# EAGLE design CANShield (EAGLE 7.3.0)

## Sheet 1 of 5
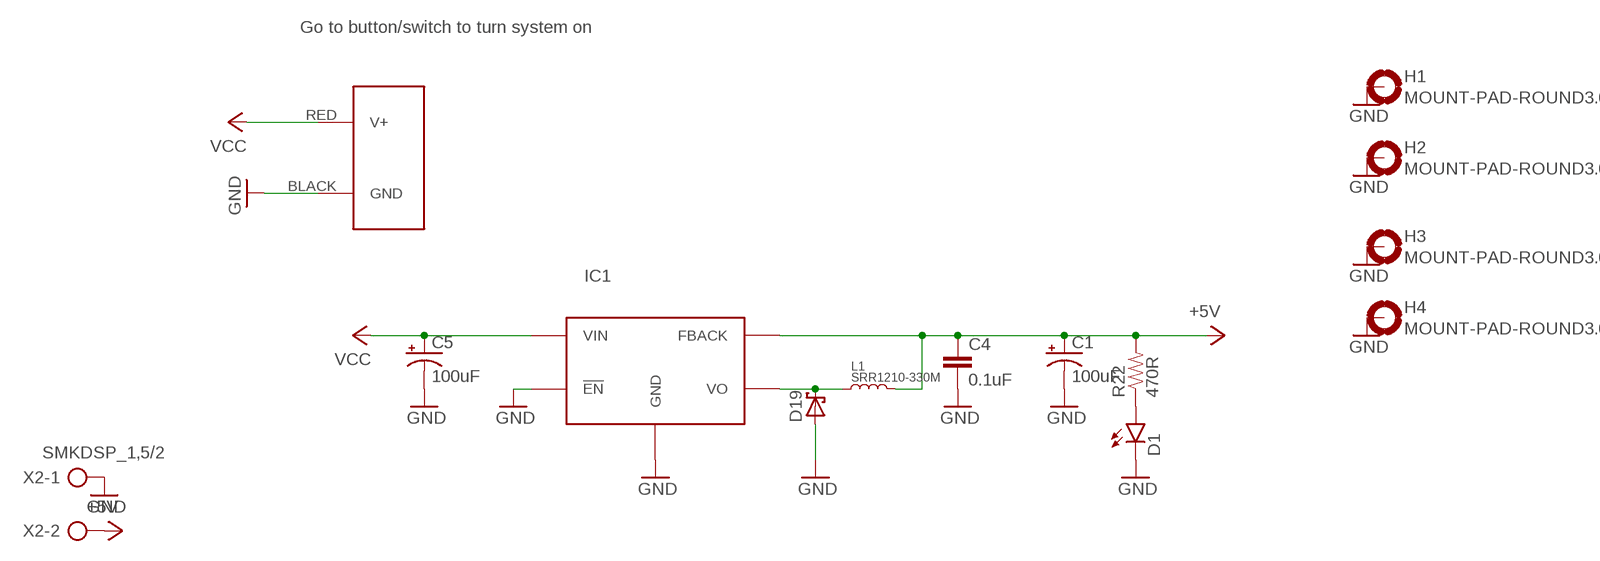
[diagram p0: schematic, sheet 1]

### Parts
C1  100uF  100UF-63V-20%(ELECT)  [NIC_10X10.5_CAP]
C4  0.1uF  CAP0603-CAP  [0603-CAP]
C5  100uF  100UF-63V-20%(ELECT)  [NIC_10X10.5_CAP]
D1  LED1206  [LED-1206]
D19  SCHOTTKY-DIODESMC  [SMC]
H1  MOUNT-PAD-ROUND3.0  [3,0-PAD]
H2  MOUNT-PAD-ROUND3.0  [3,0-PAD]
H3  MOUNT-PAD-ROUND3.0  [3,0-PAD]
H4  MOUNT-PAD-ROUND3.0  [3,0-PAD]
IC1  LM2576S  [TO263-5]
J1  POWERPOLE_POWER25A_HORIZONTAL_G2  [POWERPOLE_PAIR_25A_HORIZ_G2]
L1  SRR1210-330M  [SRR1210]
R22  470R  RESISTOR0603-RES  [0603-RES]
X2  SMKDSP_1,5/2  [SMKDSP_1,5/2]

### Nets
+5V: C1.+ C4.1 IC1.4(FBACK) L1.2 R22.2 X2.2 ; also sheet 2,3,5
GND: C1.- C4.2 C5.- D1.C D19.A H1.B3,0(MOUNT) H2.B3,0(MOUNT) H3.B3,0(MOUNT) H4.B3,0(MOUNT) IC1.3(GND) IC1.5(!EN) IC1.TAB(GND) J1.BLACK(GND) X2.1 ; also sheet 2,3,4,5
N$16: D1.A R22.1
N$40: D19.C IC1.2(VO) L1.1
VCC: C5.+ IC1.1(VIN) J1.RED(V+) ; also sheet 4

### Notes on the sheet
- Go to button/switch to turn system on

## Sheet 2 of 5
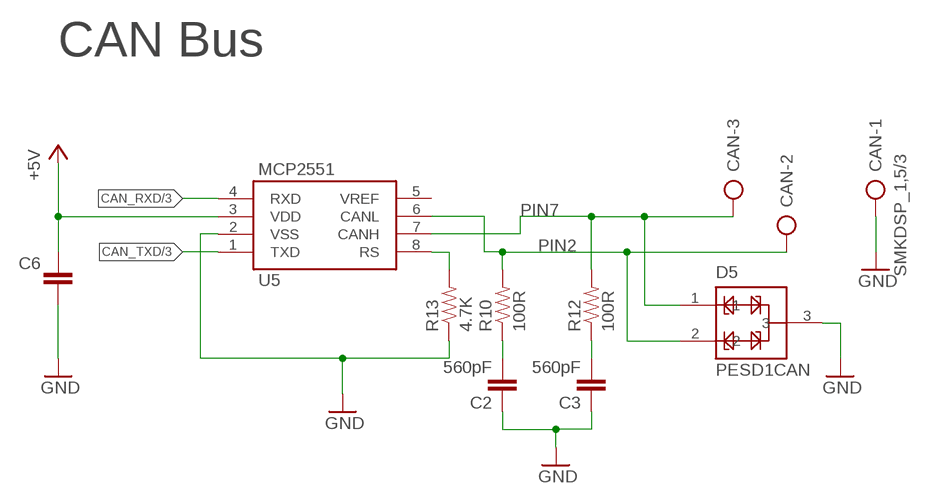
[diagram p1: schematic, sheet 2]

### Parts
C2  560pF  560PF-50V-5%(0603)  [0603-CAP]
C3  560pF  560PF-50V-5%(0603)  [0603-CAP]
C6  0.1uF  CAP0603-CAP  [0603-CAP]
CAN  SMKDSP_1,5/3  [SMKDSP_1,5/3]
D5  PESD1CAN  [SOT23-3@1]
R10  100R  100OHM-1/10W-1%(0603)  [0603-RES@1]
R12  100R  100OHM-1/10W-1%(0603)  [0603-RES@1]
R13  4.7K  4.7KOHM-1/10W-1%(0603)  [0603-RES@1]
U5  MCP2551  [SO08]

### Nets
+5V: C6.2 U5.3(VDD) ; also sheet 1,3,5
CAN_RXD: U5.4(RXD) ; also sheet 3
CAN_TXD: U5.1(TXD) ; also sheet 3
GND: C2.1 C3.1 C6.1 CAN.1 D5.3 R13.1 U5.2(VSS) ; also sheet 1,3,4,5
N$9: C2.2 R10.1
N$10: C3.2 R12.1
N$14: R13.2 U5.8(RS)
PIN2: CAN.2 D5.2 R10.2 U5.6(CANL)
PIN7: CAN.3 D5.1 R12.2 U5.7(CANH)
Unconnected: U5.5(VREF)

### Notes on the sheet
- CAN Bus

## Sheet 3 of 5
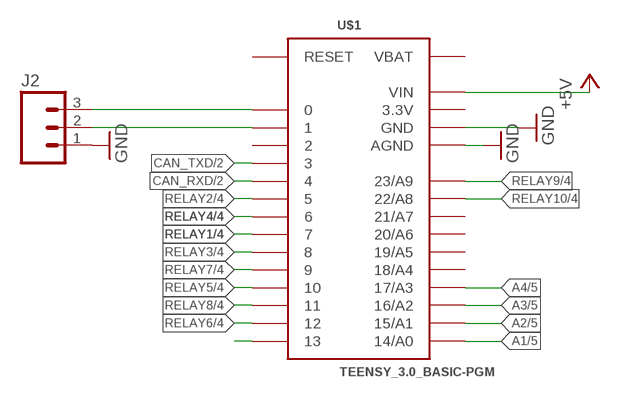
[diagram p2: schematic, sheet 3]

### Parts
J2  M03POLAR  [MOLEX-1X3]
U$1  TEENSY_3.0_BASIC-PGM  [TEENSY_3.0_BASIC-PGM]

### Nets
+5V: U$1.VIN ; also sheet 1,2,5
A1: U$1.14/A0 ; also sheet 5
A2: U$1.15/A1 ; also sheet 5
A3: U$1.16/A2 ; also sheet 5
A4: U$1.17/A3 ; also sheet 5
CAN_RXD: U$1.4 ; also sheet 2
CAN_TXD: U$1.3 ; also sheet 2
GND: J2.1 U$1.AGND U$1.GND U$1.GND1(GND) ; also sheet 1,2,4,5
N$38: J2.3 U$1.0
N$39: J2.2 U$1.1
N$46: U$1.13
RELAY1: U$1.7 ; also sheet 4
RELAY2: U$1.5 ; also sheet 4
RELAY3: U$1.8 ; also sheet 4
RELAY4: U$1.6 ; also sheet 4
RELAY5: U$1.10 ; also sheet 4
RELAY6: U$1.12 ; also sheet 4
RELAY7: U$1.9 ; also sheet 4
RELAY8: U$1.11 ; also sheet 4
RELAY9: U$1.23/A9 ; also sheet 4
RELAY10: U$1.22/A8 ; also sheet 4
Unconnected: U$1.2 U$1.18/A4 U$1.19/A5 U$1.20/A6 U$1.21/A7 U$1.RESET

## Sheet 4 of 5
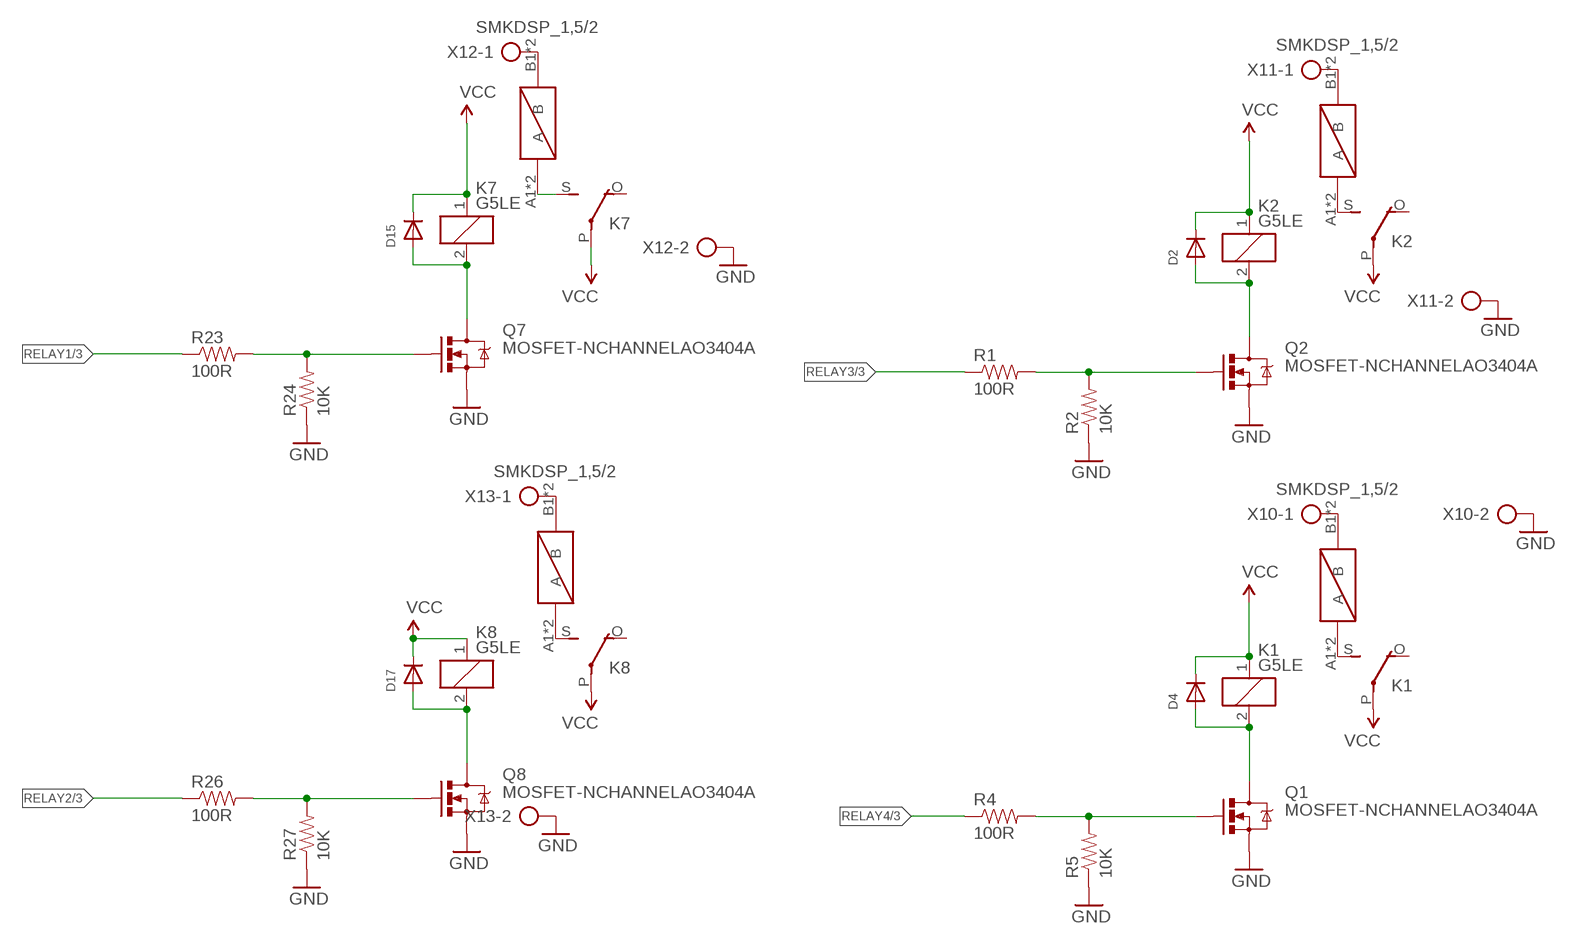
[diagram p3: schematic, sheet 4, part 1 of 2]
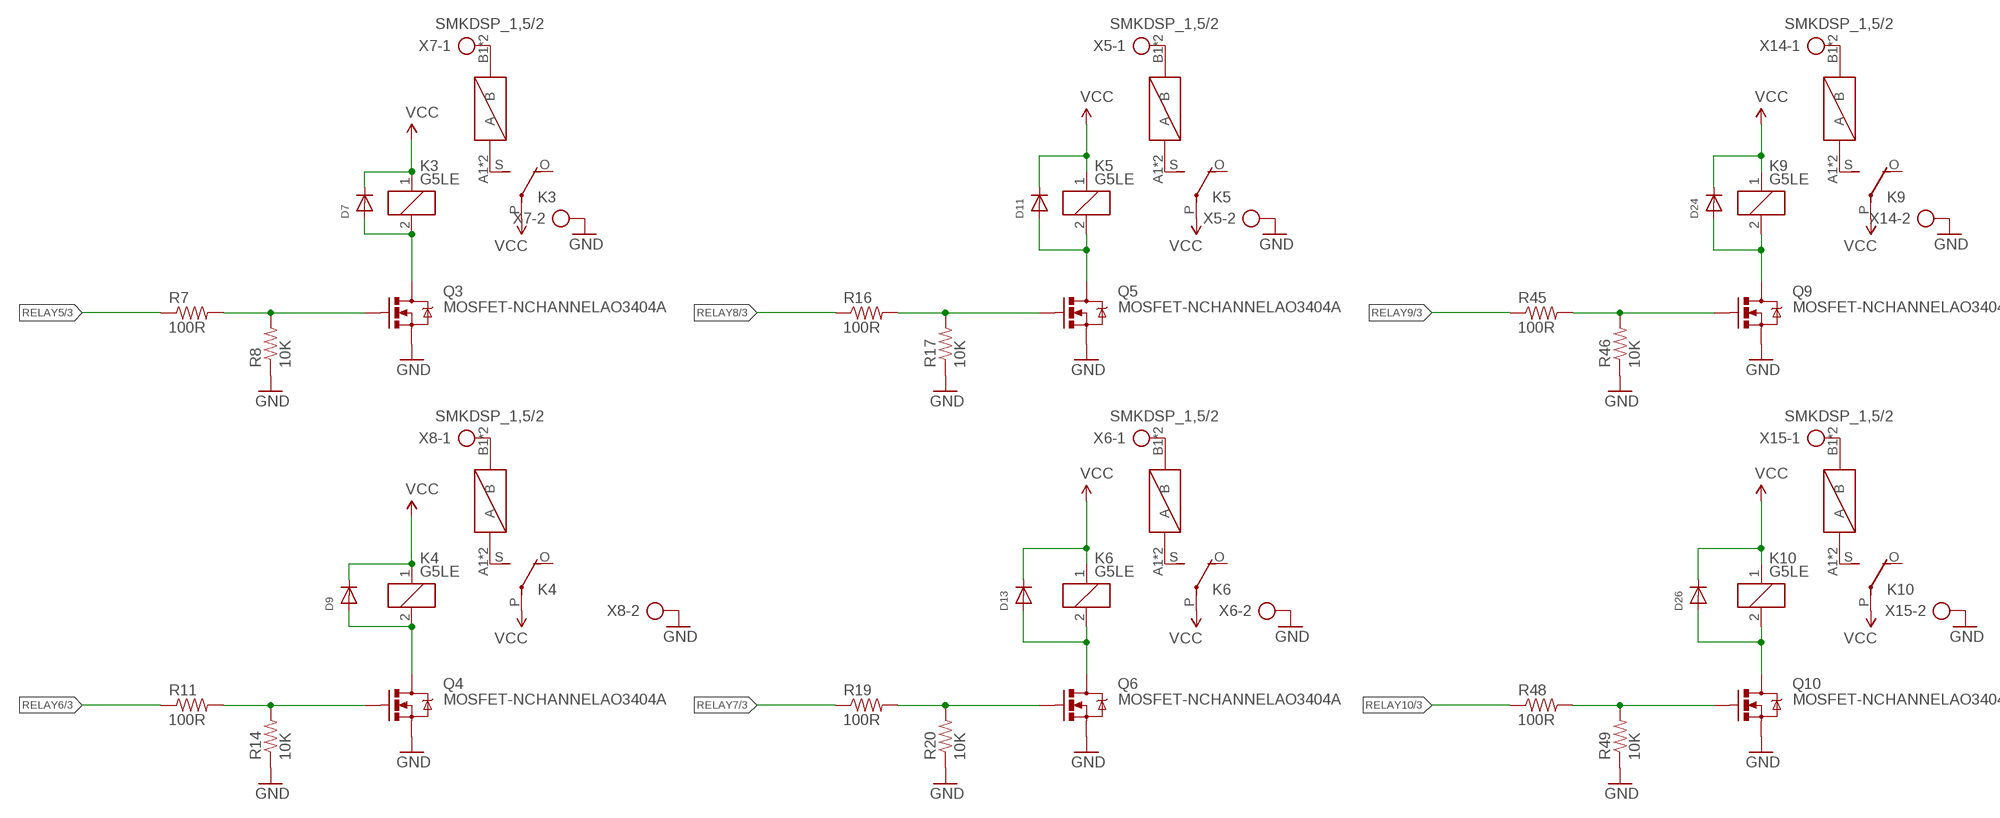
[diagram p4: schematic, sheet 4, part 2 of 2]

### Parts
D2  DIODESOD-123  [SOD-123]
D4  DIODESOD-123  [SOD-123]
D7  DIODESOD-123  [SOD-123]
D9  DIODESOD-123  [SOD-123]
D11  DIODESOD-123  [SOD-123]
D13  DIODESOD-123  [SOD-123]
D15  DIODESOD-123  [SOD-123]
D17  DIODESOD-123  [SOD-123]
D24  DIODESOD-123  [SOD-123]
D26  DIODESOD-123  [SOD-123]
K1  G5LE  [G5LE]
K2  G5LE  [G5LE]
K3  G5LE  [G5LE]
K4  G5LE  [G5LE]
K5  G5LE  [G5LE]
K6  G5LE  [G5LE]
K7  G5LE  [G5LE]
K8  G5LE  [G5LE]
K9  G5LE  [G5LE]
K10  G5LE  [G5LE]
Q1  MOSFET-NCHANNELAO3404A  [SOT23-3]
Q2  MOSFET-NCHANNELAO3404A  [SOT23-3]
Q3  MOSFET-NCHANNELAO3404A  [SOT23-3]
Q4  MOSFET-NCHANNELAO3404A  [SOT23-3]
Q5  MOSFET-NCHANNELAO3404A  [SOT23-3]
Q6  MOSFET-NCHANNELAO3404A  [SOT23-3]
Q7  MOSFET-NCHANNELAO3404A  [SOT23-3]
Q8  MOSFET-NCHANNELAO3404A  [SOT23-3]
Q9  MOSFET-NCHANNELAO3404A  [SOT23-3]
Q10  MOSFET-NCHANNELAO3404A  [SOT23-3]
R1  100R  RESISTOR0603-RES  [0603-RES]
R2  10K  RESISTOR0603-RES  [0603-RES]
R4  100R  RESISTOR0603-RES  [0603-RES]
R5  10K  RESISTOR0603-RES  [0603-RES]
R7  100R  RESISTOR0603-RES  [0603-RES]
R8  10K  RESISTOR0603-RES  [0603-RES]
R11  100R  RESISTOR0603-RES  [0603-RES]
R14  10K  RESISTOR0603-RES  [0603-RES]
R16  100R  RESISTOR0603-RES  [0603-RES]
R17  10K  RESISTOR0603-RES  [0603-RES]
R19  100R  RESISTOR0603-RES  [0603-RES]
R20  10K  RESISTOR0603-RES  [0603-RES]
R23  100R  RESISTOR0603-RES  [0603-RES]
R24  10K  RESISTOR0603-RES  [0603-RES]
R26  100R  RESISTOR0603-RES  [0603-RES]
R27  10K  RESISTOR0603-RES  [0603-RES]
R45  100R  RESISTOR0603-RES  [0603-RES]
R46  10K  RESISTOR0603-RES  [0603-RES]
R48  100R  RESISTOR0603-RES  [0603-RES]
R49  10K  RESISTOR0603-RES  [0603-RES]
U$2  FUSE  [MINIFUSE]
U$4  FUSE  [MINIFUSE]
U$5  FUSE  [MINIFUSE]
U$6  FUSE  [MINIFUSE]
U$7  FUSE  [MINIFUSE]
U$8  FUSE  [MINIFUSE]
U$9  FUSE  [MINIFUSE]
U$10  FUSE  [MINIFUSE]
U$11  FUSE  [MINIFUSE]
U$12  FUSE  [MINIFUSE]
X5  SMKDSP_1,5/2  [SMKDSP_1,5/2]
X6  SMKDSP_1,5/2  [SMKDSP_1,5/2]
X7  SMKDSP_1,5/2  [SMKDSP_1,5/2]
X8  SMKDSP_1,5/2  [SMKDSP_1,5/2]
X10  SMKDSP_1,5/2  [SMKDSP_1,5/2]
X11  SMKDSP_1,5/2  [SMKDSP_1,5/2]
X12  SMKDSP_1,5/2  [SMKDSP_1,5/2]
X13  SMKDSP_1,5/2  [SMKDSP_1,5/2]
X14  SMKDSP_1,5/2  [SMKDSP_1,5/2]
X15  SMKDSP_1,5/2  [SMKDSP_1,5/2]

### Nets
GND: Q1.2(S) Q2.2(S) Q3.2(S) Q4.2(S) Q5.2(S) Q6.2(S) Q7.2(S) Q8.2(S) Q9.2(S) Q10.2(S) R2.1 R5.1 R8.1 R14.1 R17.1 R20.1 R24.1 R27.1 R46.1 R49.1 X5.2 X6.2 X7.2 X8.2 X10.2 X11.2 X12.2 X13.2 X14.2 X15.2 ; also sheet 1,2,3,5
N$1: Q2.1(G) R1.2 R2.2
N$2: D2.A K2.2 Q2.3(D)
N$3: K3.S(2:S) U$7.A1(A) U$7.A2(A)
N$4: K4.S(2:S) U$8.A1(A) U$8.A2(A)
N$6: D4.A K1.2 Q1.3(D)
N$7: Q1.1(G) R4.2 R5.2
N$8: U$8.B1(B) U$8.B2(B) X8.1
N$12: D7.A K3.2 Q3.3(D)
N$13: Q3.1(G) R7.2 R8.2
N$15: K6.S(2:S) U$9.A1(A) U$9.A2(A)
N$18: D9.A K4.2 Q4.3(D)
N$19: Q4.1(G) R11.2 R14.2
N$22: D11.A K5.2 Q5.3(D)
N$23: Q5.1(G) R16.2 R17.2
N$26: D13.A K6.2 Q6.3(D)
N$27: Q6.1(G) R19.2 R20.2
N$30: D15.A K7.2 Q7.3(D)
N$31: Q7.1(G) R23.2 R24.2
N$34: D17.A K8.2 Q8.3(D)
N$35: Q8.1(G) R26.2 R27.2
N$41: K2.S(2:S) U$4.A1(A) U$4.A2(A)
N$45: K8.S(2:S) U$5.A1(A) U$5.A2(A)
N$50: K7.S(2:S) U$2.A1(A) U$2.A2(A)
N$53: K1.S(2:S) U$6.A1(A) U$6.A2(A)
N$55: D24.A K9.2 Q9.3(D)
N$57: Q9.1(G) R45.2 R46.2
N$59: D26.A K10.2 Q10.3(D)
N$60: Q10.1(G) R48.2 R49.2
N$62: K9.S(2:S) U$11.A1(A) U$11.A2(A)
N$63: K10.S(2:S) U$12.A1(A) U$12.A2(A)
N$64: U$2.B1(B) U$2.B2(B) X12.1
N$65: U$5.B1(B) U$5.B2(B) X13.1
N$66: U$4.B1(B) U$4.B2(B) X11.1
N$67: U$6.B1(B) U$6.B2(B) X10.1
N$68: U$9.B1(B) U$9.B2(B) X6.1
N$69: K5.S(2:S) U$10.A1(A) U$10.A2(A)
N$70: U$7.B1(B) U$7.B2(B) X7.1
N$71: U$10.B1(B) U$10.B2(B) X5.1
N$72: U$12.B1(B) U$12.B2(B) X15.1
N$73: U$11.B1(B) U$11.B2(B) X14.1
RELAY1: R23.1 ; also sheet 3
RELAY2: R26.1 ; also sheet 3
RELAY3: R1.1 ; also sheet 3
RELAY4: R4.1 ; also sheet 3
RELAY5: R7.1 ; also sheet 3
RELAY6: R11.1 ; also sheet 3
RELAY7: R19.1 ; also sheet 3
RELAY8: R16.1 ; also sheet 3
RELAY9: R45.1 ; also sheet 3
RELAY10: R48.1 ; also sheet 3
VCC: D2.C D4.C D7.C D9.C D11.C D13.C D15.C D17.C D24.C D26.C K1.1 K1.P(2:P) K2.1 K2.P(2:P) K3.1 K3.P(2:P) K4.1 K4.P(2:P) K5.1 K5.P(2:P) K6.1 K6.P(2:P) K7.1 K7.P(2:P) K8.1 K8.P(2:P) K9.1 K9.P(2:P) K10.1 K10.P(2:P) ; also sheet 1
Unconnected: K1.O(2:O) K2.O(2:O) K3.O(2:O) K4.O(2:O) K5.O(2:O) K6.O(2:O) K7.O(2:O) K8.O(2:O) K9.O(2:O) K10.O(2:O)

## Sheet 5 of 5
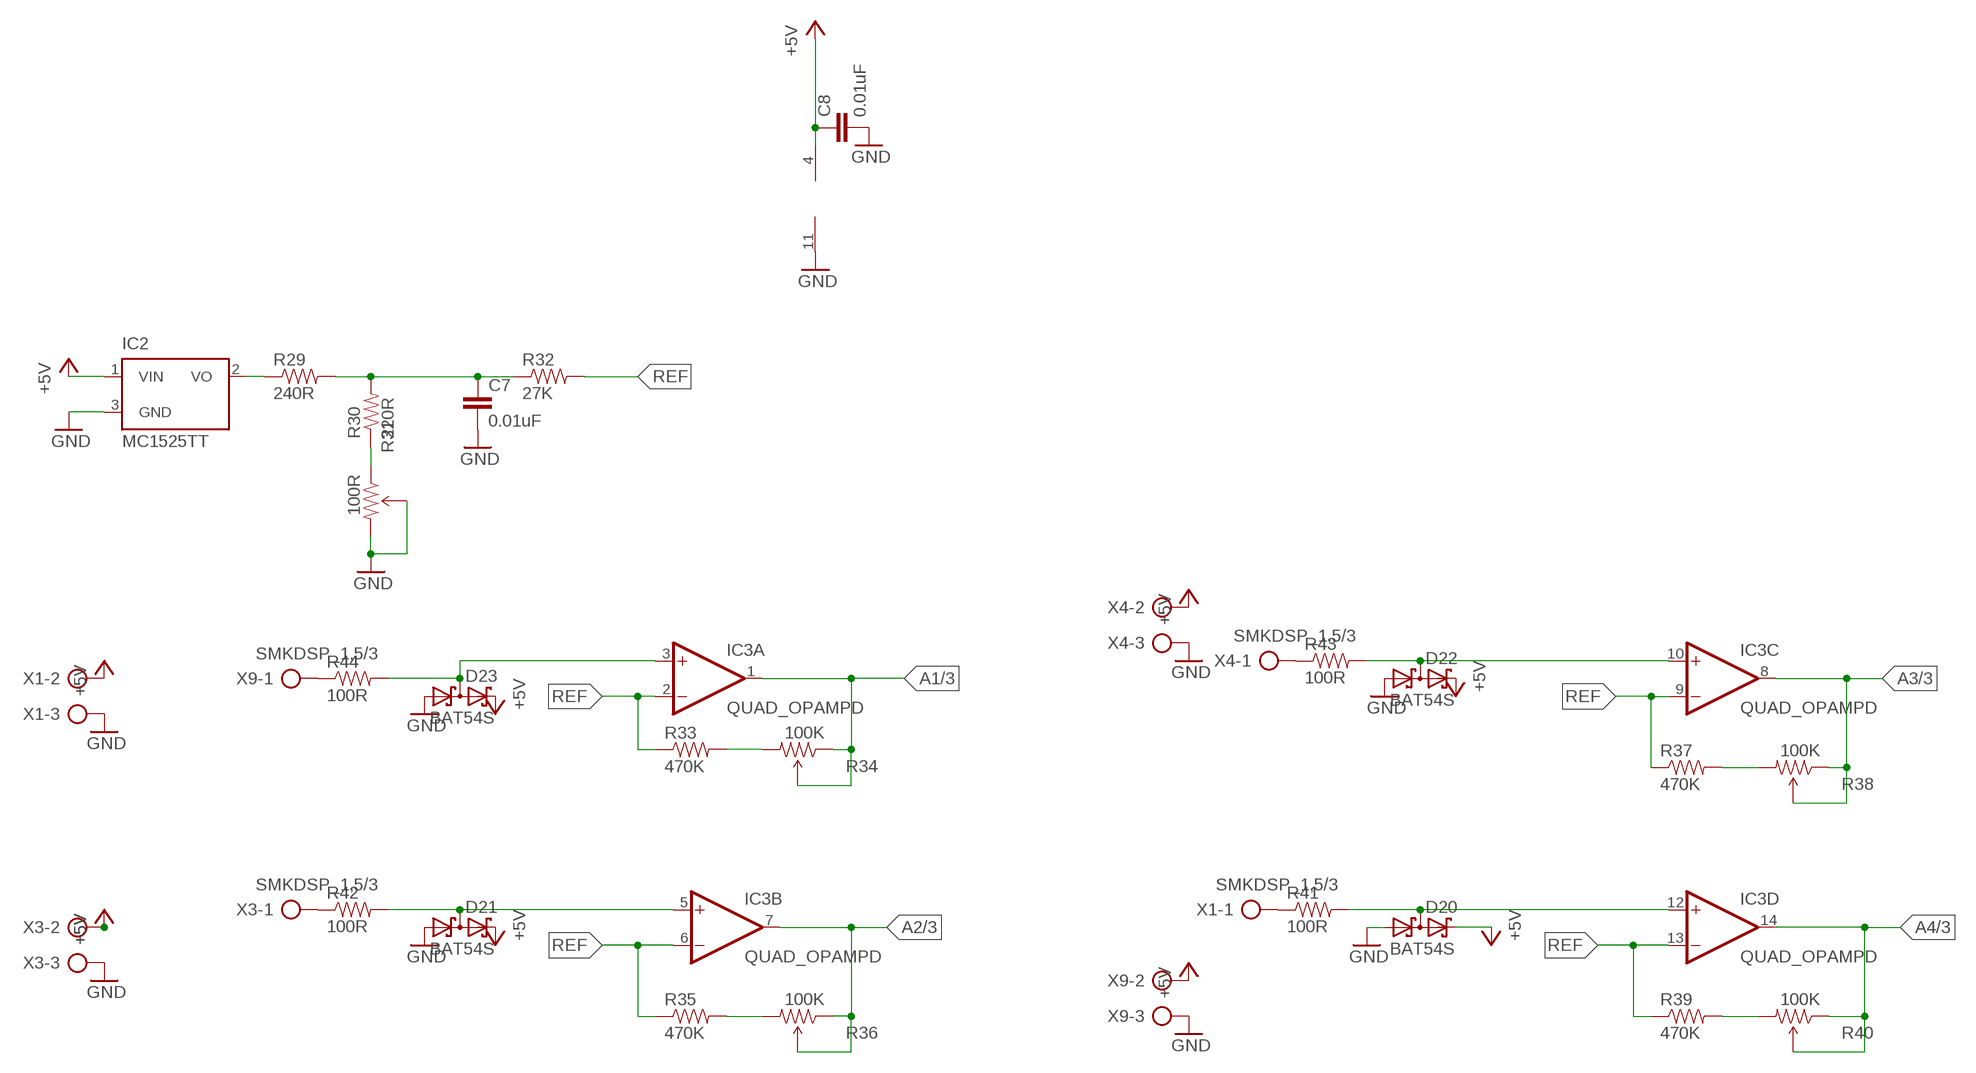
[diagram p5: schematic, sheet 5]

### Parts
C7  0.01uF  CAP0603-CAP  [0603-CAP]
C8  0.01uF  CAP0603-CAP  [0603-CAP]
D20  BAT54S  [SOT23]
D21  BAT54S  [SOT23]
D22  BAT54S  [SOT23]
D23  BAT54S  [SOT23]
IC2  MC1525TT  [SOT23]
IC3  QUAD_OPAMPD  [SO14]
R29  240R  RESISTOR0603-RES  [0603-RES]
R30  220R  RESISTOR0603-RES  [0603-RES]
R31  100R  TRIMPOTRES-09285  [TRIMPOT-3MM]
R32  27K  RESISTOR0603-RES  [0603-RES]
R33  470K  RESISTOR0603-RES  [0603-RES]
R34  100K  TRIMPOTRES-09285  [TRIMPOT-3MM]
R35  470K  RESISTOR0603-RES  [0603-RES]
R36  100K  TRIMPOTRES-09285  [TRIMPOT-3MM]
R37  470K  RESISTOR0603-RES  [0603-RES]
R38  100K  TRIMPOTRES-09285  [TRIMPOT-3MM]
R39  470K  RESISTOR0603-RES  [0603-RES]
R40  100K  TRIMPOTRES-09285  [TRIMPOT-3MM]
R41  100R  RESISTOR0603-RES  [0603-RES]
R42  100R  RESISTOR0603-RES  [0603-RES]
R43  100R  RESISTOR0603-RES  [0603-RES]
R44  100R  RESISTOR0603-RES  [0603-RES]
X1  SMKDSP_1,5/3  [SMKDSP_1,5/3]
X3  SMKDSP_1,5/3  [SMKDSP_1,5/3]
X4  SMKDSP_1,5/3  [SMKDSP_1,5/3]
X9  SMKDSP_1,5/3  [SMKDSP_1,5/3]

### Nets
+5V: C8.1 D20.2(C2) D21.2(C2) D22.2(C2) D23.2(C2) IC2.1(VIN) IC3.4(P:V+) X1.2 X3.2 X4.2 X9.2 ; also sheet 1,2,3
A1: IC3.1(A:OUT) R34.1(CCW) R34.2(WIPER) ; also sheet 3
A2: IC3.7(B:OUT) R36.1(CCW) R36.2(WIPER) ; also sheet 3
A3: IC3.8(C:OUT) R38.1(CCW) R38.2(WIPER) ; also sheet 3
A4: IC3.14(D:OUT) R40.1(CCW) R40.2(WIPER) ; also sheet 3
GND: C7.2 C8.2 D20.1(A1) D21.1(A1) D22.1(A1) D23.1(A1) IC2.3(GND) IC3.11(P:V-) R31.2(WIPER) R31.3(CW) X1.3 X3.3 X4.3 X9.3 ; also sheet 1,2,3,4
N$20: R44.1 X9.1
N$24: R42.1 X3.1
N$28: R43.1 X4.1
N$32: R41.1 X1.1
N$36: IC2.2(VO) R29.1
N$42: C7.1 R29.2 R30.2 R32.1
N$43: R30.1 R31.1(CCW)
N$44: R33.2 R34.3(CW)
N$47: D21.3(C1A2) IC3.5(B:+IN) R42.2
N$48: D20.3(C1A2) IC3.12(D:+IN) R41.2
N$49: R35.2 R36.3(CW)
N$51: D23.3(C1A2) IC3.3(A:+IN) R44.2
N$52: R39.2 R40.3(CW)
N$54: R37.2 R38.3(CW)
N$56: D22.3(C1A2) IC3.10(C:+IN) R43.2
REF: IC3.2(A:-IN) IC3.6(B:-IN) IC3.9(C:-IN) IC3.13(D:-IN) R32.2 R33.1 R35.1 R37.1 R39.1

## Power pins joined to a net without a drawn wire
3.3V: U$1.3.3V U$1.3.3V1(3.3V)
VBAT: U$1.VBAT

## Library data of the parts
C1 C5 = SparkFun-Capacitors:100UF-63V-20%(ELECT): CAP-08362 100uF electrolytic SMT 63V 20%; PROD_ID: CAP-08362
C2 C3 = SparkFun-Capacitors:560PF-50V-5%(0603): CAP-08749; PROD_ID: CAP-08749
C4 C6-C8 = SparkFun-Capacitors:CAP: Capacitor Standard 0603 ceramic capacitor, and 0.1" leaded capacitor.
CAN X1 X3 X4 X9 = con-phoenix-smkdsp:SMKDSP_1,5/3: Printklemme, Nennstrom: 17,5 A, Bemessungsspannung: 250 V, Raster: 5,0 mm Source: http://eshop.phoenixcontact.de .. 1733415.pdf; MF: FARNELL; MPN: 1733583; OC_FARNELL: 3041256; OC_NEWARK: 71C4130
D1 = SparkFun-LED:LED: LEDs Standard schematic elements and footprints for 5mm, 3mm, 1206, and 0603 sized LEDs. 5mm - Spark Fun Electronics SKU : COM-00529 (and others)
D2 D4 D7 D9 D11 D13 D15 D17 D24 D26 = adafruit:DIODE: Diode SMADIODE - SMA Surface Mount Package 20V 1A Schottky Diode Digikey: 641-1014-6-ND DO-1N4148 - Through Hole Small Current Diode SOD-123 20V 1 A (.5mV Vf) Schottky Diode - Digikey: MBRX120TPMSCT-ND SOD-323 10V 570mA (.38mV Vf, 3ns) Schottky Diode - Digikey: ZLLS410CT-ND SOD-523 30V 30mA Schottky Diode (RB751S-40TE61) - Digikey: RB751S-40TE61CT-ND SOT23-R/W - SOT23 Package (R = Solder Paste/Reflow Ovens, W = Hand-Soldering) BAT54Film 40V 300mA - Digikey: 497-7162-1-ND
D5 = SparkFun-DiscreteSemi:PESD1CAN: PESD1CAN is used to protect two automotive CAN bus lines from ESD.; PROD_ID: DIO-12501
D19 = diode:SCHOTTKY-DIODE: Schottky Diode
D20-D23 = diode:BAT54S: Schottky Diodes Pin connection corrected 2011-05-04 Source: Fairchild .. BAT54.pdf
H1-H4 = holes:MOUNT-PAD-ROUND: MOUNTING PAD, round
IC1 = AWJLEagleLib:LM2576: Texas Instruments LM2576 Simple Switcher
IC2 = microchip:MC15*: 2.5V and 4.096V Voltage References Source: http://www.microchip.com .. 21653b.pdf; OC_FARNELL: unknown; OC_NEWARK: unknown
IC3 = adafruit:QUAD_OPAMP: OP AMP Standard quad package
J1 = powerpoles:POWERPOLE_POWER: Anderson Powerpole Power Connector using ameteur radio standard layout
J2 = SparkFun-Connectors:M03: Header 3 Standard 3-pin 0.1" header. Use with straight break away headers (SKU : PRT-00116), right angle break away headers (PRT-00553), swiss pins (PRT-00743), machine pins (PRT-00117), and female headers (PRT-00115). Molex polarized connector foot print use with SKU : PRT-08232 with associated crimp pins and housings.
K1-K10 = relay:G5LE: RELAY 1 x switch, 10 A/120 V AC, 8 A/30 V DC, Omron; OC_FARNELL: unknown; OC_NEWARK: unknown
L1 = Bourns:SRR1210
Q1-Q10 = SparkFun-DiscreteSemi:MOSFET-NCHANNEL: Common NMOSFET Parts MFG P/N Store ID Prod ID FDD8780 TRANS-09984 SI7820DN TRANS-11055 FDS6630A IC-08089 2N7002PW TRANS-11151 FQP30N06L COM-10213 TRANS-10060 BSS123LT1G TRANS-08345 BSS138 TRANS-00830 BS170 2N7000; PROD_ID: TRAN-12988
R1 R2 R4 R5 R7 R8 R11 R14 R16 R17 R19 R20 R22-R24 R26 R27 R29 R30 R32 R33 R35 R37 R39 R41-R46 R48 R49 = SparkFun-Passives:RESISTOR: Resistor Basic schematic elements and footprints for 0603, 1206, and PTH resistors.
R10 R12 = SparkFun-Resistors:100OHM-1/10W-1%(0603): RES-07863; PROD_ID: RES-07863; VALUE: 100
R13 = SparkFun-Resistors:4.7KOHM-1/10W-1%(0603): RES-07857; PROD_ID: RES-07857
R31 R34 R36 R38 R40 = SparkFun-Electromechanical:TRIMPOT: Various small potentiometers for "set-and-forget" applications; PROD_ID: RES-09285; VALUE: 10k
U5 = SparkFun-DigitalIC:MCP2551: CAN transceiver; PROD_ID: IC-09907
U$1 = Teensy3.0:TEENSY_3.0_BASIC-PGM: Teensy 3.0 Board outline identical to other 'basic' version except that 'PGM' pin has been omitted. See '+4', 'AllAnalogPins", and 'AllPins' packages for additional pin holes, as needed.
U$2 U$4-U$12 = grant:FUSE
X2 X5-X8 X10-X15 = con-phoenix-smkdsp:SMKDSP_1,5/2: Printklemme, Nennstrom: 17,5 A, Bemessungsspannung: 250 V, Raster: 5,0 mm Source: http://eshop.phoenixcontact.de .. 1733415.pdf; MF: FARNELL; MPN: 1733570; OC_FARNELL: 3041244; OC_NEWARK: 69C8588

## Board
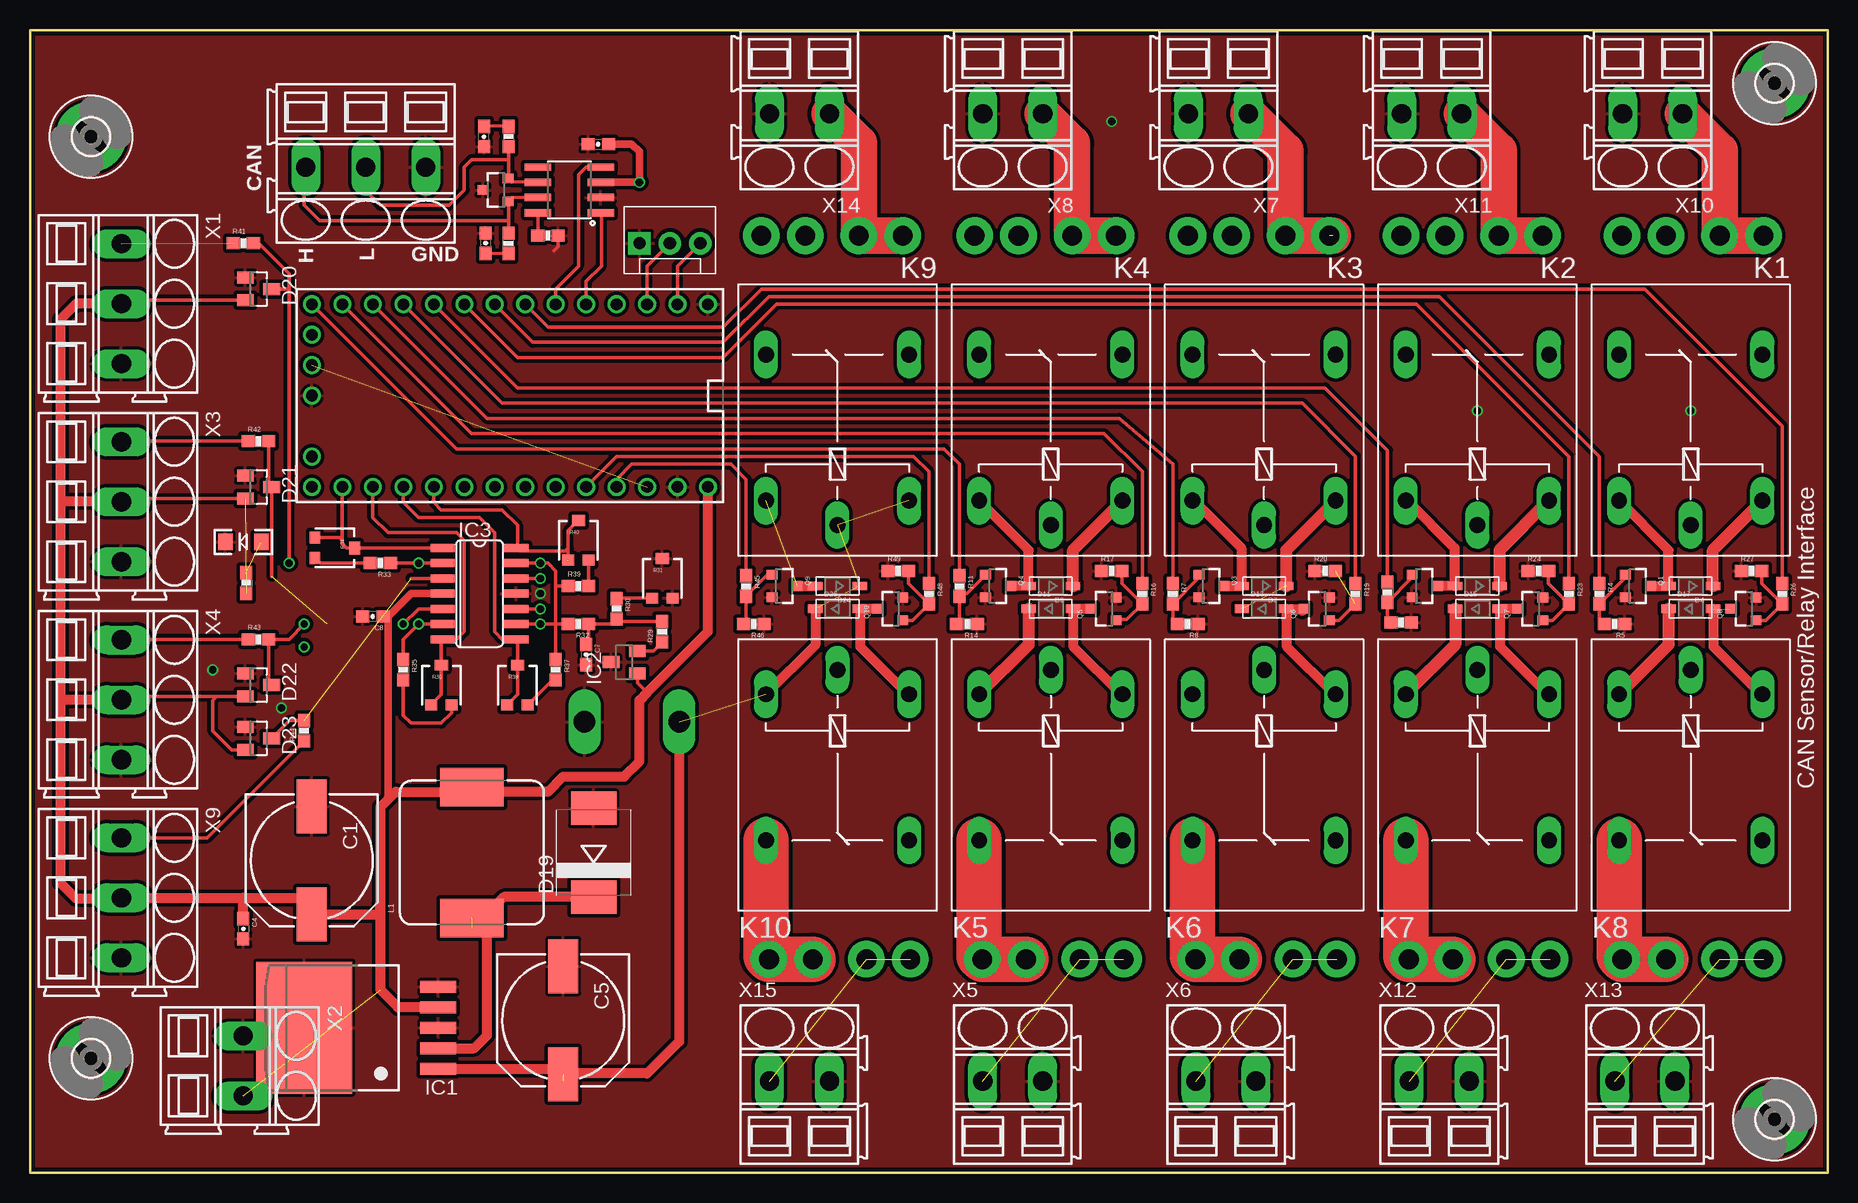
[diagram p6: board, top side]
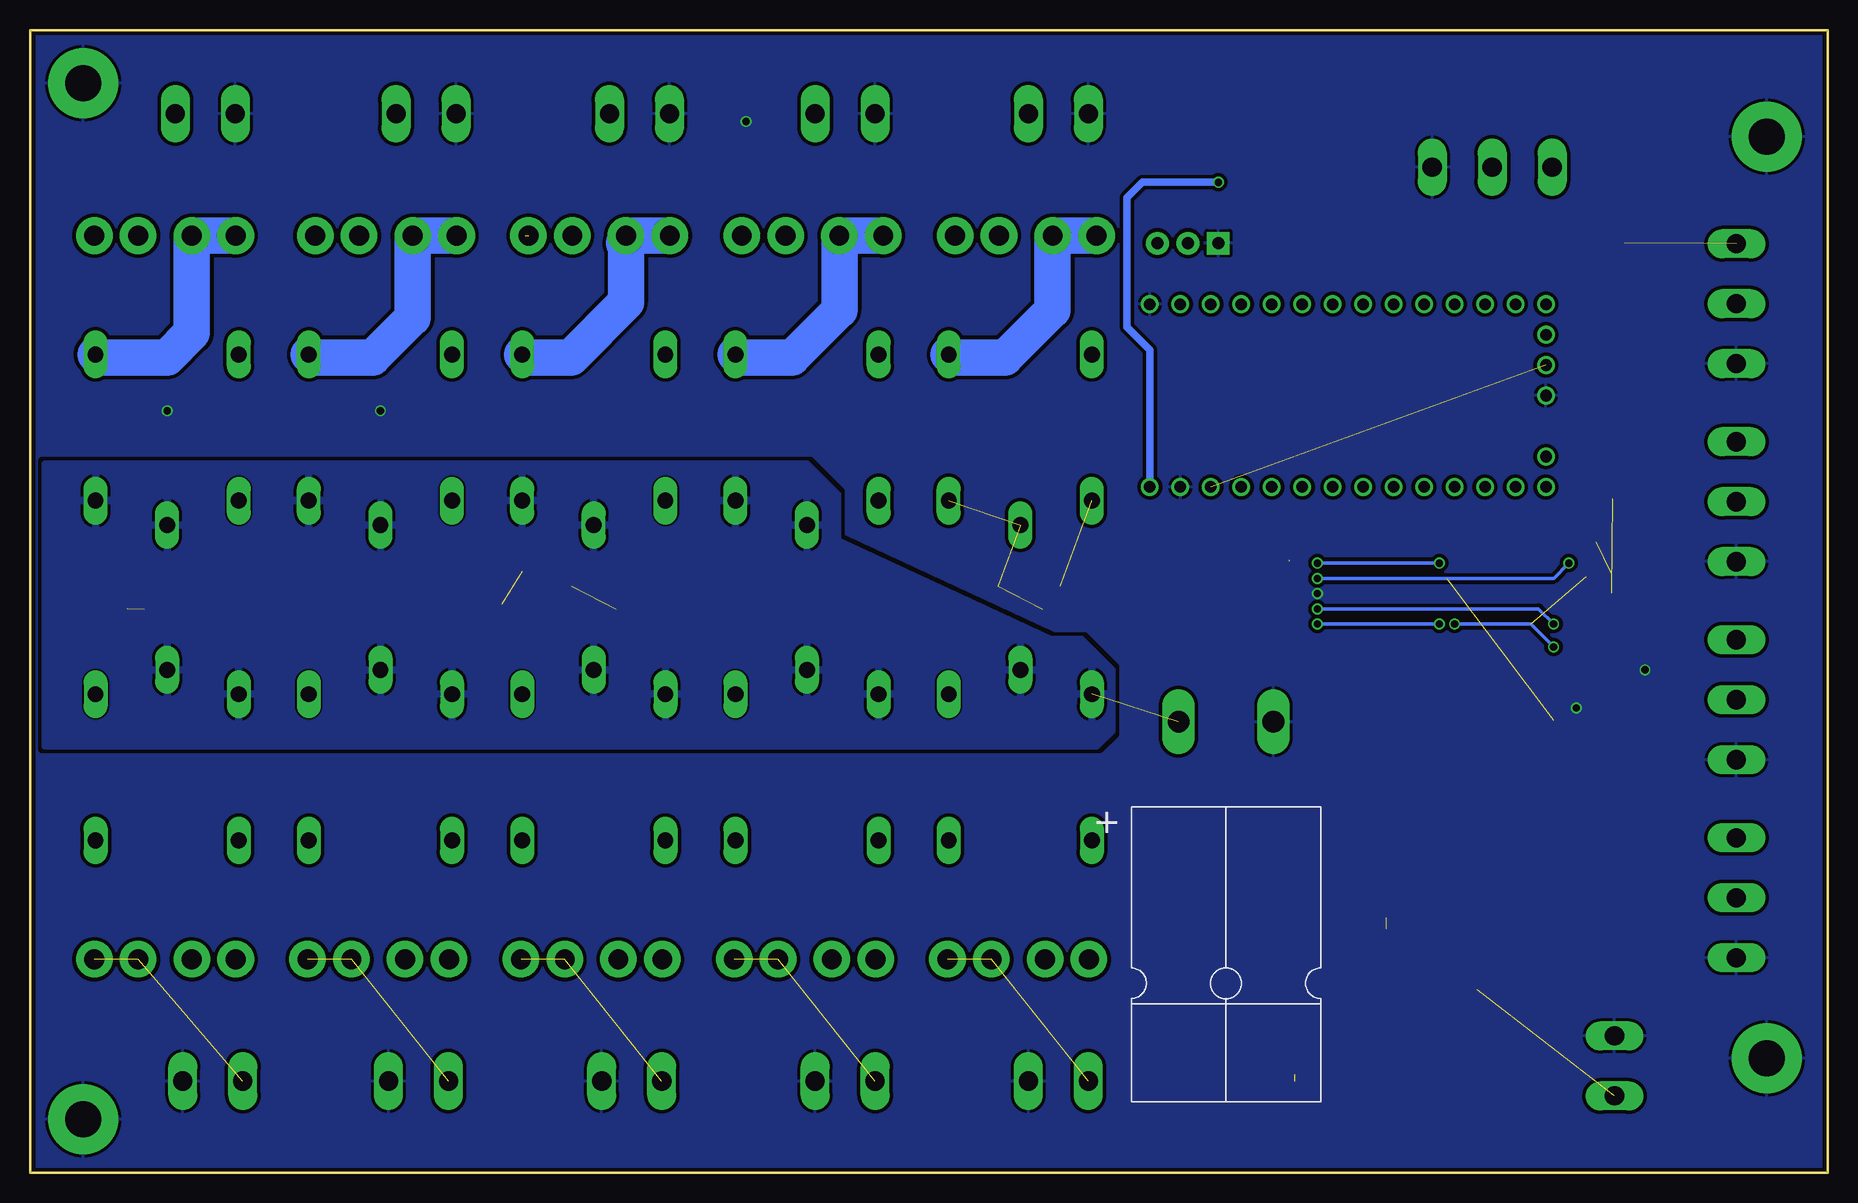
[diagram p7: board, bottom side, seen from below]

Size 149.86 x 95.25 mm. Coordinates in mm from the lower left corner, seen from the top.
Outline: 0,0 0,95.25 149.86,95.25 149.86,0 0,0
Copper layers (1*16): Top 0.035mm / dielectric 1.5mm / Bottom 0.035mm
Design rules "SeeedStudio_2layer_DRU_no_angle_20140221": minimum track width 6mil, minimum drill 12mil, track to track 6mil, track to pad 6mil, pad to pad 6mil, via to via 6mil, smd to smd 0mil, copper to edge 10mil, drill to drill 10mil, minimum pad ring 10mil, minimum via ring 6mil, stop-mask expansion 2mil, vias tented up to drill 100mil, thermal gap 10mil

### Footprints (pad centres in the part's own frame; a part is rotated, then mirrored left to right if it is on the bottom)
NIC_10X10.5_CAP = smd 4.5 x 2.5: + 4.5,0; - -4.5,0
0603-CAP = smd 1.1 x 1: 1 -0.85,0; 2 0.85,0
SMKDSP_1,5/3 = drill 1.6 pad 1.8 long: 1 -2.5,0; 2 2.5,0; 3 7.5,0
LED-1206 = smd 1.2 x 1.4: A -1.5,0; C 1.5,0
SOD-123 = smd 1.2 x 0.7: A 1.85,0; C -1.85,0
SOT23-3@1 = smd 0.8 x 0.9: 1 -0.95,-1; 2 0.95,-1; 3 0,1.1
SMC = smd 2.8 x 3.8: A 3.7,0; C -3.7,0
SOT23 = smd 1 x 1.4: 1 -0.95,-1.1; 2 0.95,-1.1; 3 0,1.1
3,0-PAD = drill 3 pad 5.842: B3,0 0,0
TO263-5 = smd 1 x 3: 1 -3.4,-8; 2 -1.7,-8; 3 0,-8; 4 1.7,-8; 5 3.4,-8 | smd 11 x 8: TAB 0,3.175
SO14 = smd 0.66 x 2.032: 1 -3.81,-3.073; 2 -2.54,-3.073; 3 -1.27,-3.073; 4 0,-3.073; 5 1.27,-3.073; 6 2.54,-3.073; 7 3.81,-3.073; 8 3.81,3.073; 9 2.54,3.073; 10 1.27,3.073; 11 0,3.073; 12 -1.27,3.073; 13 -2.54,3.073; 14 -3.81,3.073
POWERPOLE_PAIR_25A_HORIZ_G2 = drill 1.8 long: BLACK -3.95,-7.1; RED 3.95,-7.1
MOLEX-1X3 = drill 1.016 pad 1.88 square: 1 0,0 | drill 1.016 pad 1.88: 2 2.54,0; 3 5.08,0
G5LE = drill 1.321 long: 1 -7.493,-5.969; 2 -7.493,5.969; O 4.699,5.969; P -9.525,0; S 4.699,-5.969
SRR1210 = smd 3.2 x 5.3: 1 -5.45,0; 2 5.45,0
SOT23-3 = smd 0.8 x 0.9: 1 -0.95,-1; 2 0.95,-1; 3 0,1.1
0603-RES = smd 1.1 x 1: 1 -0.85,0; 2 0.85,0
0603-RES@1 = smd 1.1 x 1: 1 -0.85,0; 2 0.85,0
TRIMPOT-3MM = smd 1 x 0.9: 1 -0.85,-1.65; 3 0.85,-1.65 | smd 1.1 x 0.9: 2 0,1.65
SO08 = smd 0.61 x 2.21: 1 -1.905,-2.616; 2 -0.635,-2.616; 3 0.635,-2.616; 4 1.905,-2.616; 5 1.905,2.616; 6 0.635,2.616; 7 -0.635,2.616; 8 -1.905,2.616
TEENSY_3.0_BASIC-PGM = drill 0.965: 0 -7.62,13.97; 1 -7.62,11.43; 2 -7.62,8.89; 3 -7.62,6.35; 3.3V 7.62,11.43; 3.3V1 -2.54,-16.51; 4 -7.62,3.81; 5 -7.62,1.27; 6 -7.62,-1.27; 7 -7.62,-3.81; 8 -7.62,-6.35; 9 -7.62,-8.89; 10 -7.62,-11.43; 11 -7.62,-13.97; 12 -7.62,-16.51; 13 7.62,-16.51; 14/A0 7.62,-13.97; 15/A1 7.62,-11.43; 16/A2 7.62,-8.89; 17/A3 7.62,-6.35; 18/A4 7.62,-3.81; 19/A5 7.62,-1.27; 20/A6 7.62,1.27; 21/A7 7.62,3.81; 22/A8 7.62,6.35; 23/A9 7.62,8.89; AGND 7.62,13.97; GND -7.62,16.51; GND1 0,-16.51; RESET 5.08,-16.51; VBAT -5.08,-16.51; VIN 7.62,16.51
MINIFUSE = drill 1.651 pad 3.048: A1 0,0; A2 3.658,0; B1 8.128,0; B2 11.786,0
SMKDSP_1,5/2 = drill 1.6 pad 1.8 long: 1 -2.5,0; 2 2.5,0

### Placement (x,y rotation side)
C1  23.5,26.04 270 top
C2  37.85,86.36 90 top
C3  37.97,77.47 270 top
C4  17.78,20.32 270 top
C5  44.45,12.7 270 top
C6  47.37,85.73 0 top
C7  46.35,43.18 270 top
C8  28.57,46.36 180 top
CAN  30.48,83.82 180 top
D1  17.78,52.58 180 top
D2  120.65,48.9 180 top
D4  138.43,48.9 180 top
D5  38.86,81.92 90 top
D7  102.87,48.9 180 top
D9  85.09,48.9 180 top
D11  85.09,46.99 0 top
D13  102.87,46.99 0 top
D15  120.65,46.99 0 top
D17  138.43,46.99 0 top
D19  46.99,26.67 90 top
D20  19.05,73.66 270 top
D21  19.05,57.15 270 top
D22  19.05,40.64 270 top
D23  19.05,36.2 270 top
D24  67.31,48.9 180 top
D26  67.31,46.99 0 top
H1  5.08,86.36 0 top
H2  145.41,90.81 0 top
H3  145.41,4.45 0 top
H4  5.08,9.53 0 top
IC1  26.04,12.07 90 top
IC2  49.53,42.55 90 top
IC3  37.47,48.26 270 top
J1  50.16,30.48 180 bottom
J2  50.8,77.47 0 top
K1  138.43,63.5 90 top
K2  120.65,63.5 90 top
K3  102.87,63.5 90 top
K4  85.09,63.5 90 top
K5  85.09,32.38 270 top
K6  102.87,32.38 270 top
K7  120.65,32.38 270 top
K8  138.43,32.38 270 top
K9  67.31,63.5 90 top
K10  67.31,32.38 270 top
L1  36.83,26.67 90 top
Q1  133.99,48.9 270 top
Q2  116.2,48.9 270 top
Q3  98.42,48.9 270 top
Q4  80.64,48.9 270 top
Q5  89.53,46.99 90 top
Q6  107.31,46.99 90 top
Q7  125.09,46.99 90 top
Q8  142.88,46.99 90 top
Q9  62.87,48.9 270 top
Q10  71.75,46.99 90 top
R1  113.16,48.39 270 top
R2  114.3,45.85 180 top
R4  130.81,48.26 270 top
R5  132.08,45.72 180 top
R7  95.25,48.26 270 top
R8  96.52,45.72 180 top
R10  39.88,86.36 270 top
R11  77.47,48.9 270 top
R12  39.88,77.47 90 top
R13  43.18,78.11 180 top
R14  78.11,45.72 180 top
R16  92.71,48.26 270 top
R17  90.17,50.16 0 top
R19  110.49,48.26 270 top
R20  107.95,50.16 0 top
R22  18.03,49.15 270 top
R23  128.27,48.26 270 top
R24  125.73,50.16 0 top
R26  146.05,48.26 270 top
R27  143.51,50.16 0 top
R29  52.7,45.09 90 top
R30  48.9,46.99 270 top
R31  52.7,49.53 0 top
R32  45.72,45.72 180 top
R33  29.21,50.8 180 top
R34  25.4,52.07 270 top
R35  31.11,41.91 270 top
R36  34.29,40.64 0 top
R37  43.81,41.91 270 top
R38  40.64,40.64 0 top
R39  45.72,48.9 0 top
R40  45.72,52.71 0 top
R41  17.78,77.47 0 top
R42  19.05,60.96 0 top
R43  19.05,44.45 0 top
R44  22.86,36.83 90 top
R45  59.69,48.9 270 top
R46  60.33,45.72 180 top
R48  74.93,48.26 270 top
R49  72.39,50.16 0 top
U5  44.96,81.92 90 top
U$1  40.01,64.77 270 top
U$2  114.94,17.78 0 top
U$3  [PROS_LOGO]  169.16,17.78 90 top  (outside the outline)
U$4  114.3,78.11 0 top
U$5  132.72,17.78 0 top
U$6  132.72,78.11 0 top
U$7  96.52,78.11 0 top
U$8  78.74,78.11 0 top
U$9  97.16,17.78 0 top
U$10  79.38,17.78 0 top
U$11  60.96,78.11 0 top
U$12  61.59,17.78 0 top
X1  7.62,74.93 270 top
X2  17.78,8.89 270 top
X3  7.62,58.42 270 top
X4  7.62,41.91 270 top
X5  81.92,7.62 0 top
X6  99.69,7.62 0 top
X7  99.06,88.27 180 top
X8  81.92,88.27 180 top
X9  7.62,25.4 270 top
X10  135.25,88.27 180 top
X11  116.84,88.27 180 top
X12  117.47,7.62 0 top
X13  134.62,7.62 0 top
X14  64.14,88.27 180 top
X15  64.14,7.62 0 top

### Tracks (layer width: path | path; a pad name or v marks a point on that pad's centre or on a via)
3.3V  (1 unrouted)
+5V  (via drill 0.6)  (2 unrouted)
  Top 0.305: X3.2 7.9,56.2 D21.2 | D20.2 7.9,72.71 X1.2 | X4.2 7.9,39.69 D22.2 15.56,39.69 15.24,39.37 15.24,36.83 16.82,35.24 D23.2 | 29.84,46.36 C8.1 | IC2.1 50.63,40.81 51.44,40.01
  Top 0.61: U5.3 v50.8,82.55 50.8,85.09 50.16,85.73 C6.2 | IC3.4 31.75,48.26 29.84,46.36 29.84,31.11
  Top 0.813: IC1.4 30.68,13.77 29.21,15.24 29.21,22.86 | 29.21,22.86 29.21,30.48 29.84,31.11 30.48,31.75 37.2,31.75 | 29.21,22.86 29.16,21.54 C1.+ 23.4,22.9 17.78,22.9 | X1.2 3.85,72.43 2.54,71.12 2.54,55.88 | 2.54,55.88 2.54,39.37 | 2.54,39.37 2.54,24.13 3.81,22.86 7.58,22.86 X9.2 17.78,22.9 | X4.2 2.58,39.41 2.54,39.37 | X3.2 2.58,55.92 2.54,55.88 | C4.1 17.78,22.9 | 37.2,31.75 43.18,31.75 44.45,33.02 49.53,33.02 50.8,34.29 50.8,39.37 51.44,40.01 56.52,45.09 U$1.VIN | 37.2,31.75 L1.2
  Bottom 0.61: U$1.VIN 56.52,68.58 58.42,70.48 58.42,81.28 57.15,82.55 v50.8,82.55
A1
  Top 0.305: 26.04,52.71 26.04,52.45 26.41,52.07 R34.2 IC3.1 | 26.04,52.71 U$1.14/A0 | R34.1 25.82,52.92 26.04,52.71
A2
  Top 0.305: U$1.15/A1 28.57,54.61 29.84,53.34 35.56,53.34 36.2,52.71 36.2,45.09 35.56,44.45 IC3.7 34.29,44.35 R36.2 34.29,39.84 R36.1
A3
  Top 0.305: U$1.16/A2 31.11,55.88 32.38,54.61 37.47,54.61 38.73,53.34 38.73,45.09 39.37,44.45 IC3.8 40.64,44.35 R38.2 40.64,39.84 R38.1
A4  (1 unrouted)
  Top 0.305: U$1.17/A3 33.66,55.88 34.29,55.25 39.37,55.25 40.64,53.98 40.64,52.17 IC3.14 40.79,51.82 44.62,51.82 44.87,52.07 | 44.87,50.97 44.87,52.07 | 44.87,52.07 44.87,53.51 R40.2
CAN_RXD
  Top 0.305: U5.4 46.35,83.82 45.72,83.19 45.72,75.56 43.81,73.66 U$1.4
CAN_TXD
  Top 0.305: U5.1 47.62,79.96 47.62,75.56 46.35,74.3 U$1.3
  Top 0.406: 47.7,80.14 U5.1
GND  (via drill 0.6)
  Top 0.305: R13.1 44.03,77.18 43.69,76.84
  other vias: 90.17,87.63 42.55,48.26 120.65,63.5 138.43,63.5 20.95,38.73 15.24,41.91
  pour Bottom (isolate 0.305, rank 2): 0,0 0,95.25 149.86,95.25 149.86,0
  pour Top (isolate 0.305, rank 2): 0,0 0,95.25 149.86,95.25 149.86,0
N$1
  Top 0.305: Q2.1 115.2,49.59 R1.2 113.16,46.14 R2.2
N$2
  Top 0.813: Q2.3 D2.A 118.75,48.95 118.75,52.07 114.81,56.01 K2.2
N$3
  Bottom 3.048: U$7.A2 100.18,77.47 | 100.18,77.47 100.18,72.54 104.78,67.95 108.58,67.95 K3.S | U$7.A1 99.69,78.11 100.33,77.47 100.18,77.47
N$4
  Bottom 3.048: K4.S 90.81,67.95 86.36,67.95 82.4,71.91 U$8.A2 U$8.A1
N$6
  Top 0.813: K1.2 136.58,51.89 D4.A Q1.3
N$7
  Top 0.305: R5.2 130.81,46.14 R4.2 132.99,49.59 Q1.1
N$8
  Top 3.048: U$8.B2 U$8.B1 86.87,85.81 X8.1
N$9
  Top 0.254: R10.1 C2.2
N$10
  Top 0.254: R12.1 C3.2
N$12
  Top 0.813: Q3.3 D7.A 100.97,48.95 100.97,52.07 97.03,56.01 K3.2
N$13
  Top 0.305: Q3.1 97.42,49.59 R7.2 95.25,46.14 R8.2
N$14
  Top 0.305: U5.8 42.34,78.12 R13.2
N$15
  Top 3.81: K6.S 96.9,18.03 U$9.A1 U$9.A2
N$16  (1 unrouted)
N$18
  Top 0.813: K4.2 83.24,51.89 D9.A Q4.3
N$19
  Top 0.305: Q4.1 79.64,49.8 78.11,48.26 77.69,48.26 R11.2 77.47,45.94 R14.2
N$20
  Top 0.305: X9.1 14.78,27.9 R44.1
N$22
  Top 0.813: K5.2 90.93,39.88 87,43.82 87,46.94 D11.A Q5.3
N$23
  Top 0.305: Q5.1 90.53,46.09 91.39,46.09 R16.2 91.02,49.1 R17.2
N$24
  Top 0.305: X3.1 7.66,60.96 R42.1
N$26
  Top 0.813: 106.05,46.82 Q6.3 D13.A 104.78,46.94 104.78,43.82 108.71,39.88 K6.2
N$27  (1 unrouted)
  Top 0.305: Q6.1 109.12,46.04 R19.2
N$28
  Top 0.305: R43.1 7.66,44.45 X4.1
N$30
  Top 0.813: Q7.3 D15.A 122.56,46.94 122.56,43.82 126.49,39.88 K7.2
N$31
  Top 0.305: Q7.1 126.9,46.04 R23.2 126.58,49.1 R24.2
N$32  (1 unrouted)
N$34  (1 unrouted)
  Top 0.813: K8.2 144.27,39.88 140.34,43.82 140.34,46.94 D17.A
N$35
  Top 0.305: Q8.1 144.68,46.04 R26.2 144.36,49.1 R27.2
N$36
  Top 0.305: IC2.2 51.97,43.5 R29.1
N$38
  Top 0.305: U$1.0 53.98,75.56 J2.3
N$39
  Top 0.305: U$1.1 51.44,75.56 J2.2
N$40  (1 unrouted)
  Top 0.813: IC1.2 37.03,10.37 38.1,11.43 38.1,20.32 37.73,20.32 L1.1 | D19.C 39.48,22.97 36.83,20.32
N$41
  Bottom 3.048: K2.S 126.36,67.95 121.28,67.95 117.96,71.27 U$4.A2 U$4.A1
N$42
  Top 0.305: C7.1 46.57,44.25 R32.1 48.48,45.72 R30.2 49.1,45.94 R29.2
N$43
  Top 0.305: R31.1 48.94,47.88
  Top 0.61: 48.94,47.88 R30.1
N$44
  Top 0.305: R33.2 24.17,50.8 R34.3
N$45
  Top 3.81: K8.S 132.46,18.03 U$5.A1 U$5.A2
N$47  (via drill 0.6)  (1 unrouted)
  Top 0.305: R42.2 19.9,57.4 D21.3 20.15,49.7 | IC3.5 32.38,46.99 v31.11,45.72
  Bottom 0.305: v31.11,45.72 24.77,45.72 v22.86,43.82
N$48  (via drill 0.6)
  Top 0.305: R41.2 19.05,77.47 21.59,74.93 21.59,73.66 | D20.3 21.59,73.66 | v42.55,49.53 IC3.12 | v21.59,50.8 21.59,73.66
  Bottom 0.305: v42.55,49.53 22.86,49.53 v21.59,50.8
N$49
  Top 0.305: R36.3 35.14,38.32 34.29,37.47 31.75,37.47 31.11,38.1 R35.2
N$50
  Top 3.81: K7.S 114.68,18.03 U$2.A1 U$2.A2
N$51  (1 unrouted)
  Top 0.305: R44.2 21.64,37.68 D23.3 | IC3.3 31.75,49.53
N$52
  Top 0.305: R40.3 R39.2
N$53
  Bottom 3.048: U$6.A2 136.37,77.47 | 136.37,77.47 136.37,70 138.43,67.95 144.15,67.95 K1.S | U$6.A1 135.74,78.11 136.37,77.47
N$54
  Top 0.305: R37.2 43.56,41.06 R38.3
N$55  (1 unrouted)
  Top 0.813: Q9.3 D24.A
N$56  (via drill 0.6)
  Top 0.305: IC3.10 v42.55,46.99 | D22.3 19.9,40.89 R43.2 21.59,44.45 v22.86,45.72
  Bottom 0.305: v42.55,46.99 24.13,46.99 v22.86,45.72
N$57
  Top 0.305: R46.2 59.69,45.94 R45.2 61.49,49.84 Q9.1
N$59
  Top 0.406: 73.15,39.88 73.15,38.86
  Top 0.813: Q10.3 D26.A 69.22,46.94 69.22,43.82 73.15,39.88 K10.2
N$60
  Top 0.305: Q10.1 73.56,46.04 R48.2 73.24,49.1 R49.2
N$62
  Bottom 3.048: K9.S 73.03,67.95 68.58,67.95 64.62,71.91 U$11.A2 U$11.A1
N$63
  Top 3.81: K10.S 61.34,18.03 U$12.A1 U$12.A2
N$64  (2 unrouted)
N$65  (2 unrouted)
N$66
  Top 3.048: U$4.B2 U$4.B1 122.43,85.18 X11.1
N$67
  Top 3.048: U$6.B2 U$6.B1 140.84,85.18 X10.1
N$68  (2 unrouted)
N$69
  Top 3.81: K5.S 79.12,18.03 U$10.A1 U$10.A2
N$70  (1 unrouted)
  Top 3.048: 108.58,78.11 U$7.B1 104.65,85.18 X7.1
N$71  (2 unrouted)
N$72  (2 unrouted)
N$73
  Top 3.048: U$11.B2 U$11.B1 69.09,85.81 X14.1
PIN2
  Top 0.254: D5.2 40.18,82.55 U5.6
  Top 0.305: R10.2 39.88,84.45 | 39.88,84.45 39.88,82.88 D5.2 | 39.88,84.45 36.83,84.45 36.2,83.82 36.2,81.92 34.92,80.64 29.21,80.64 27.98,81.88 CAN.2
PIN7
  Top 0.254: U5.7 40.18,81.28 D5.1 39.88,80.95 39.88,80.64
  Top 0.305: 39.88,80.64 39.88,79.38 | 39.88,79.38 R12.2 | 39.8,81.03 D5.1 | 39.88,79.38 24.13,79.38 22.86,80.64 22.86,83.7 CAN.3
REF  (via drill 0.6)
  Top 0.305: 43.81,45.72 v42.55,45.72 IC3.9 | 43.81,45.72 R32.2 | IC3.6 v32.38,45.72 31.11,44.45 R35.1 | IC3.2 v32.38,50.8 R33.1 | IC3.13 v42.55,50.8 43.18,50.8 43.81,50.16 43.81,48.9 | 43.81,48.9 43.81,45.72 | R39.1 43.81,48.9 | 43.81,45.72 R37.1
  Bottom 0.305: v32.38,45.72 v42.55,45.72 | v32.38,50.8 v42.55,50.8
RELAY1
  Top 0.305: R23.1 128.27,59.69 115.57,72.39 62.23,72.39 57.78,67.95 40.64,67.95 U$1.7
RELAY2
  Top 0.305: R26.1 146.05,62.23 134.62,73.66 60.96,73.66 57.78,70.48 43.18,70.48 U$1.5
RELAY3
  Top 0.305: R1.1 113.16,60.2 107.95,65.41 40.64,65.41 U$1.8
RELAY4
  Top 0.305: R4.1 130.81,59.69 117.47,73.03 61.59,73.03 57.78,69.22 41.91,69.22 U$1.6
RELAY5
  Top 0.305: R7.1 95.25,59.05 90.81,62.87 38.1,62.87 U$1.10
RELAY6
  Top 0.305: U$1.12 35.56,60.33 76.2,60.33 77.47,59.05 R11.1
RELAY7
  Top 0.305: R19.1 110.49,59.69 106.05,64.14 39.37,64.14 U$1.9
RELAY8
  Top 0.305: R16.1 92.71,58.42 89.53,61.59 36.83,61.59 U$1.11
RELAY9
  Top 0.305: 59.69,50.16 R45.1 59.69,57.79 58.42,59.05 50.16,59.05 48.9,57.79 U$1.23/A9
RELAY10
  Top 0.305: R48.1 74.93,58.42 73.66,59.69 48.9,59.69 U$1.22/A8
VCC  (6 unrouted)
  Top 0.813: IC1.1 43.98,8.67 C5.+ 44.51,8.26 | J1.RED 54.12,10.94 51.44,8.26 45.09,8.26 44.45,7.62 | D26.C 65.46,44 K10.1
  Top 1.016: D11.C 83.24,44 K5.1 | D9.C 86.94,51.89 K4.1 | D7.C 104.72,51.89 K3.1 | D15.C 118.8,44 K7.1 | D2.C 122.5,51.89 K2.1 | D4.C 140.28,51.89 K1.1 | D17.C 136.58,44 K8.1
  pour Bottom: 60.96,35.56 148.59,35.56 148.59,59.05 85.09,59.05 82.55,56.52 82.55,52.71 64.77,44.45 62.23,44.45 59.69,41.91 59.69,36.83

### Text on the board
tPlace: CAN | H | L | GND | CAN Sensor/Relay Interface